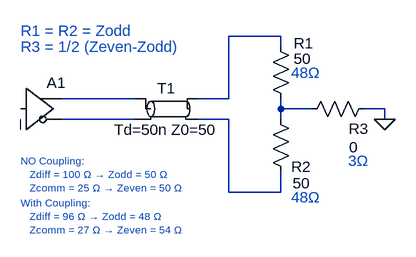
[diagram p0: schematic Tee_Termination.asc]
Tee_Termination.asc, the LTspice schematic file:
Version 4
SHEET 1 880 680
WIRE 384 32 304 32
WIRE 384 48 384 32
WIRE 160 128 48 128
WIRE 304 128 304 32
WIRE 304 128 256 128
WIRE 384 144 384 128
WIRE 432 144 384 144
WIRE 544 144 512 144
WIRE 160 160 48 160
WIRE 304 160 256 160
WIRE 384 160 384 144
WIRE 544 160 544 144
WIRE 304 272 304 160
WIRE 384 272 384 240
WIRE 384 272 304 272
FLAG 544 160 0
SYMBOL Digital\\buf -16 80 R0
SYMATTR InstName A1
SYMBOL tline 208 144 R0
SYMATTR InstName T1
SYMBOL res 368 32 R0
WINDOW 0 36 11 Left 2
WINDOW 3 36 35 Left 2
SYMATTR InstName R1
SYMATTR Value 50
SYMBOL res 368 144 R0
WINDOW 0 32 89 Left 2
WINDOW 3 34 114 Left 2
SYMATTR InstName R2
SYMATTR Value 50
SYMBOL res 528 128 R90
WINDOW 0 62 24 VBottom 2
WINDOW 3 59 32 VTop 2
SYMATTR InstName R3
SYMATTR Value 0
TEXT -16 224 Left 1 ;NO Coupling:\n   Zdiff = 100 Ω → Zodd = 50 Ω\n   Zcomm = 25 Ω → Zeven = 50 Ω
TEXT -16 288 Left 1 ;With Coupling:\n   Zdiff = 96 Ω → Zodd = 48 Ω\n   Zcomm = 27 Ω → Zeven = 54 Ω
TEXT 400 88 Left 2 ;48Ω
TEXT 400 280 Left 2 ;48Ω
TEXT -16 24 Left 2 ;R1 = R2 = Zodd
TEXT -16 48 Left 2 ;R3 = 1/2 (Zeven-Zodd)
TEXT 488 224 Left 2 ;3Ω

The netlist it stands for:
* Tee_Termination.asc
A1 0 0 0 0 0 N004 N002 0 BUF
T1 N002 N004 N001 N005 Td=50n Z0=50
R1 N001 N003 50
R2 N003 N005 50
R3 0 N003 0
* NO Coupling:
*    Zdiff = 100 Ω → Zodd = 50 Ω
*    Zcomm = 25 Ω → Zeven = 50 Ω
* With Coupling:
*    Zdiff = 96 Ω → Zodd = 48 Ω
*    Zcomm = 27 Ω → Zeven = 54 Ω
* 48Ω
* 48Ω
* R1 = R2 = Zodd
* R3 = 1/2 (Zeven-Zodd)
* 3Ω
.backanno
.end